# Altium schematic sheet SCH.SchDoc
size A4
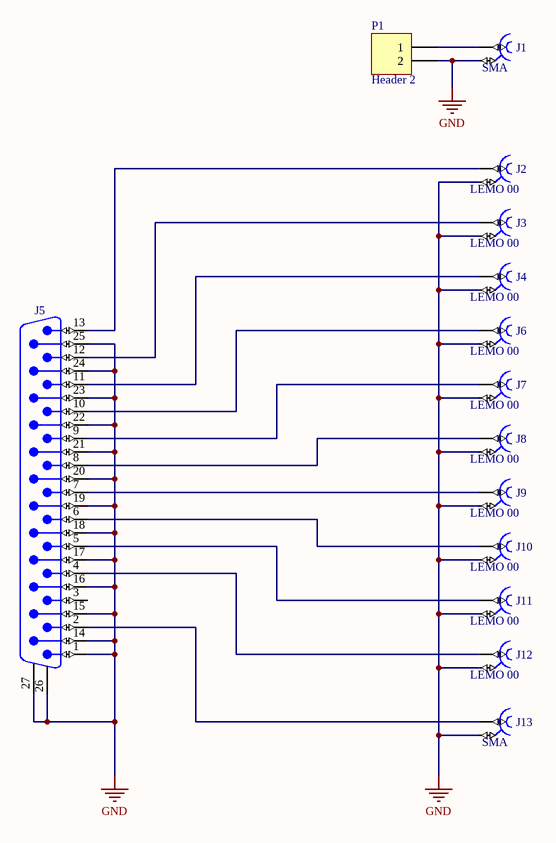
[diagram p0: SCH.SchDoc]

## Parts
J1  SMA  [AMPHENOL_132134]
J2  LEMO 00  [LEMO_EPK.00.250.NTN]
J3  LEMO 00  [LEMO_EPK.00.250.NTN]
J4  LEMO 00  [LEMO_EPK.00.250.NTN]
J5  D-Sub  [TYCO_3-1634582-2]  (value not drawn)
J6  LEMO 00  [LEMO_EPK.00.250.NTN]
J7  LEMO 00  [LEMO_EPK.00.250.NTN]
J8  LEMO 00  [LEMO_EPK.00.250.NTN]
J9  LEMO 00  [LEMO_EPK.00.250.NTN]
J10  LEMO 00  [LEMO_EPK.00.250.NTN]
J11  LEMO 00  [LEMO_EPK.00.250.NTN]
J12  LEMO 00  [LEMO_EPK.00.250.NTN]
J13  SMA  [AMPHENOL_132134]
P1  Header 2  [HDR1X2]

## Nets
GND: J1.2 J2.2 J3.2 J4.2 J5.1 J5.14 J5.15 J5.16 J5.17 J5.18 J5.19 J5.20 J5.21 J5.22 J5.23 J5.24 J5.25 J5.26 J5.27 J6.2 J7.2 J8.2 J9.2 J10.2 J11.2 J12.2 J13.2 P1.2
NetJ1_1: J1.1 P1.1
NetJ2_1: J2.1 J5.13
NetJ3_1: J3.1 J5.12
NetJ4_1: J4.1 J5.11
NetJ5_2: J5.2 J13.1
NetJ5_4: J5.4 J12.1
NetJ5_5: J5.5 J11.1
NetJ5_6: J5.6 J10.1
NetJ5_7: J5.7 J9.1
NetJ5_8: J5.8 J8.1
NetJ5_9: J5.9 J7.1
NetJ5_10: J5.10 J6.1

Not connected (* = marked no-connect by the designer): J5 3

## Library data of the parts
J1 J13 = AMPHENOL_132134: Part Description: 50 Ohm Through Hole SMA Straight PCB Jack; Manufacturer Part Number: 132134; PressFit: No; Part Number: AMPHENOL_132134; Component Kind: Standard; Component Type: Standard; Pin Count: 4; Family: SMA; Mounted: Yes; Socket: No; SMD: No; Sense: No; Status: None; Manufacturer: AMPHENOL; ComponentHeight: 9.53mm; HelpURL: \\cern.ch\dfs\Applications\Altium\Datasheets\AMPHENOL_132134.pdf; Author: CERN DEM JLC; CreateDate: 16.12.2013; LatestRevisionDate: 16.12.2013
J2-J4 J6-J12 = LEMO_EPK.00.250.NTN: Part Description: Size 00, 50 Ohms Coaxial Elbow (90°) socket With Clearance Under The Body; PressFit: No; SCEM: 09.46.11.180.6; Part Number: LEMO_EPK.00.250.NTN; Component Kind: Standard; Component Type: Standard; Pin Count: 2; Family: LEMO 00; Mounted: Yes; Socket: No; SMD: No; Sense: No; Status: None; Manufacturer: LEMO; Manufacturer Part Number: EPK.00.250.NTN; ComponentHeight: 7mm; HelpURL: \\cern.ch\dfs\Applications\Altium\Datasheets\LEMO_EPK.00.250.NTN.pdf; Author: CERN DEM JLC; CreateDate: 04.09.2012; LatestRevisionDate: 04.09.2012
J5 = TYCO_3-1634582-2: Connector D-sub 25 Male; Part Description: Right Angle 25 Male Contacts D-SUB Connector With Boardlock and 4-40 UNC Screwlocks; Manufacturer: TYCO ELECTRONICS; PressFit: No; Part Number: TYCO_3-1634582-2; Component Kind: Standard; Component Type: Standard; Pin Count: 27; Family: D-Sub; Mounted: Yes; Socket: No; SMD: No; Sense: No; Status: None; Manufacturer Part Number: 3-1634582-2; ComponentHeight: 13.57mm; HelpURL: \\cern.ch\dfs\Applications\Altium\Datasheets\TYCO_3-1634582-2.pdf; Author: CERN DEM JLC; CreateDate: 17.01.2013; LatestRevisionDate: 17.01.2013
P1 = Header 2: Header, 2-Pin; LatestRevisionDate: 17-Jul-2002; LatestRevisionNote: Re-released for DXP Platform.; Publisher: Altium Limited